# EAGLE design FinalDesign (EAGLE 9.6.2)
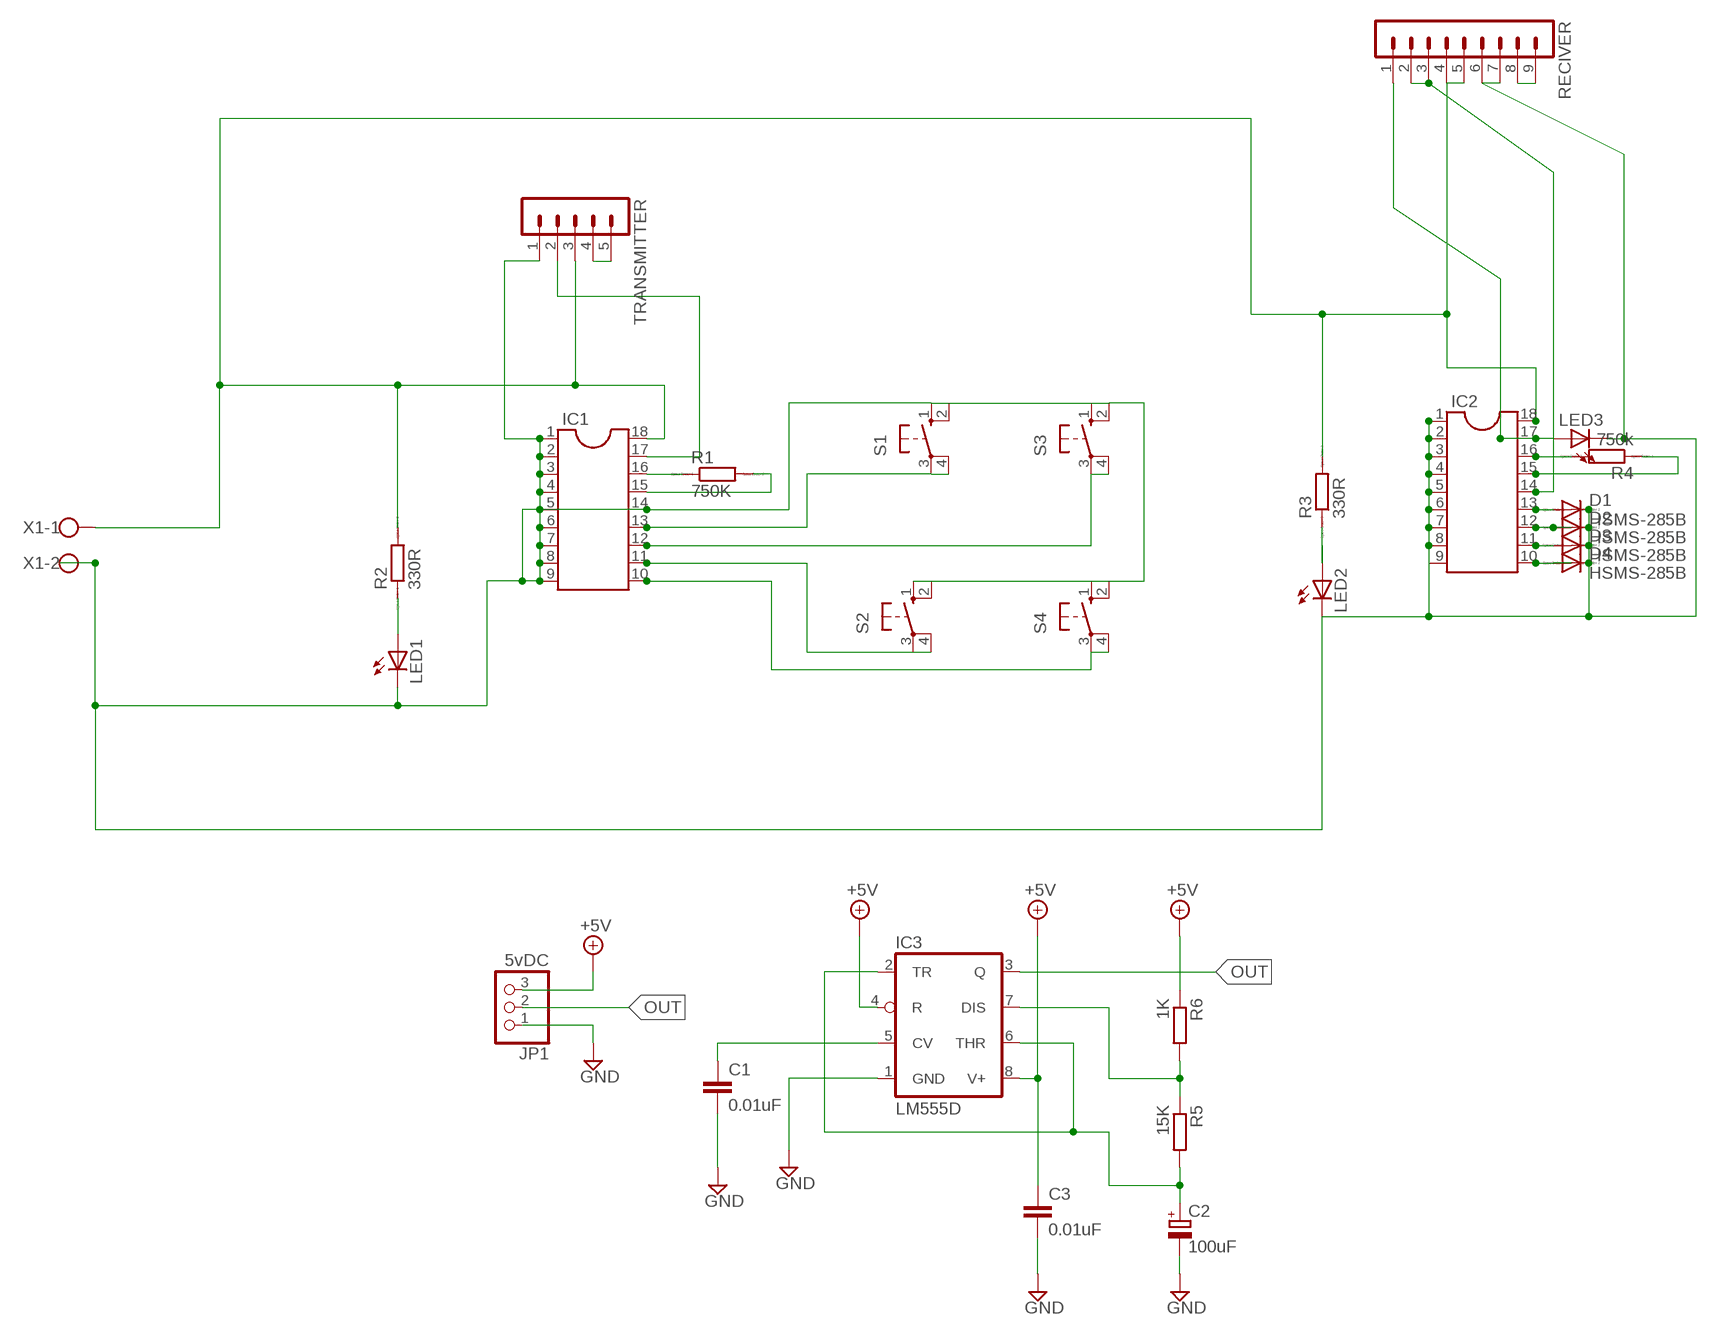
[diagram p0: schematic, sheet 1]

## Parts
C1  0.01uF  C-EUC0805  [C0805]
C2  100uF  CPOL-EUE2.5-5  [E2,5-5]
C3  0.01uF  C-EUC0805  [C0805]
D1  HSMS-285B  [SOT323]
D2  HSMS-285B  [SOT323]
D3  HSMS-285B  [SOT323]
D4  HSMS-285B  [SOT323]
IC1  DIL18  [DIL18]
IC2  DIL18  [DIL18]
IC3  LM555D  [SO08]
JP1  5vDC  PINHD-1X3  [1X03]
LED1  LED5MM  [LED5MM]
LED2  LED5MM  [LED5MM]
LED3  LED5MM  [LED5MM]
R1  750K  R0207/10  [0207/10]
R2  330R  R0207/10  [0207/10]
R3  330R  R0204/7  [0204/7]
R4  750k  R0204/7  [0204/7]
R5  15K  R-EU_M0805  [M0805]
R6  1K  R-EU_M0805  [M0805]
RECIVER  MA09-1  [MA09-1]
S1  10-XX  [B3F-10XX]
S2  10-XX  [B3F-10XX]
S3  10-XX  [B3F-10XX]
S4  10-XX  [B3F-10XX]
TRANSMITTER  MA05-1  [MA05-1]
X1  W237-102  [W237-102]

## Nets
+5V: C3.1 IC3.4(R) IC3.8(V+) JP1.3 R6.1
GND: C1.2 C2.- C3.2 D1.3(C) D2.3(C) D3.3(C) D4.3(C) IC1.1 IC1.2 IC1.3 IC1.4 IC1.5 IC1.6 IC1.7 IC1.8 IC1.9 IC1.14 IC2.1 IC2.2 IC2.3 IC2.4 IC2.5 IC2.6 IC2.7 IC2.8 IC2.9 IC3.1(GND) JP1.1 LED1.K(C) LED2.K(C) LED3.K(C) RECIVER.6 RECIVER.7 S1.1(S) S1.2(S1) S2.1(S) S2.2(S1) S3.1(S) S3.2(S1) S4.1(S) S4.2(S1) TRANSMITTER.1 X1.2
N$1: LED2.A R3.1
N$2: IC1.13 S1.3(P) S1.4(P1)
N$3: LED1.A R2.1
N$4: IC1.16 R1.1
N$5: IC1.15 R1.2
N$6: IC1.11 S2.3(P) S2.4(P1)
N$7: C1.1 IC3.5(CV)
N$8: D1.1(A) IC2.13
N$9: IC1.10 S4.3(P) S4.4(P1)
N$10: IC1.12 S3.3(P) S3.4(P1)
N$11: D2.1(A) IC2.12
N$12: D3.1(A) IC2.11
N$13: D4.1(A) IC2.10
N$14: TRANSMITTER.4 TRANSMITTER.5
N$15: IC1.17 TRANSMITTER.2
N$16: RECIVER.8 RECIVER.9
N$17: IC2.17 LED3.A RECIVER.1
N$18: IC2.16 R4.2
N$19: IC2.15 R4.1
N$20: C2.+ IC3.2(TR) IC3.6(THR) R5.2
N$21: IC2.14 RECIVER.2 RECIVER.3
N$22: IC3.7(DIS) R5.1 R6.2
OUT: IC3.3(Q) JP1.2
VCC: IC1.18 IC2.18 R2.2 R3.2 RECIVER.4 RECIVER.5 TRANSMITTER.3 X1.1

## Library data of the parts
C1 C3 = rcl:C-EU: CAPACITOR, European symbol; SPICEPREFIX: C
C2 = rcl:CPOL-EU: POLARIZED CAPACITOR, European symbol; SPICEPREFIX: C
D1-D4 = avago:HSMS-285B: Surface Mount Microwave Schottky Detector Diodes Source: Data sheet <http://www.farnell.com/datasheets/461166.pdf>
IC1 IC2 = ic-package:DIL18: Dual In Line / Socket
IC3 = linear:*555: TIMER
JP1 = pinhead:PINHD-1X3: PIN HEADER
LED1-LED3 = led:LED: LED OSRAM: - CHIPLED LG R971, LG N971, LY N971, LG Q971, LY Q971, LO R971, LY R971 LH N974, LH R974 LS Q976, LO Q976, LY Q976 LO Q996 - Hyper CHIPLED LW Q18S LB Q993, LB Q99A, LB R99A - SideLED LS A670, LO A670, LY A670, LG A670, LP A670 LB A673, LV A673, LT A673, LW A673 LH A674 LY A675 LS A676, LA A676, LO A676, LY A676, LW A676 LS A679, LY A679, LG A679 - Hyper Micro SIDELED® LS Y876, LA Y876, LO Y876, LY Y876 LT Y87S - SmartLED LW L88C, LW L88S LB L89C, LB L89S, LG L890 LS L89K, LO L89K, LY L89K LS L896, LA L896, LO L896, LY L896 - TOPLED LS T670, LO T670, LY T670, LG T670, LP T670 LSG T670, LSP T670, LSY T670, LOP T670, LYG T670 LG T671, LOG T671, LSG T671 LB T673, LV T673, LT T673, LW T673 LH T674 LS T676, LA T676, LO T676, LY T676, LB T676, LH T676, LSB T676, LW T676 LB T67C, LV T67C, LT T67C, LS T67K, LO T67K, LY T67K, LW E67C LS E67B, LA E67B, LO E67B, LY E67B, LB E67C, LV E67C, LT E67C LW T67C LS T679, LY T679, LG T679 LS T770, LO T770, LY T770, LG T770, LP T770 LB T773, LV T773, LT T773, LW T773 LH T774 LS E675, LA E675, LY E675, LS T675 LS T776, LA T776, LO T776, LY T776, LB T776 LHGB T686 LT T68C, LB T68C - Hyper Mini TOPLED® LB M676 - Mini TOPLED Santana® LG M470 LS M47K, LO M47K, LY M47K Source: http://www.osram.convergy.de LUXEON: - LUMILED® LXK2-PW12-R00, LXK2-PW12-S00, LXK2-PW14-U00, LXK2-PW14-V00 LXK2-PM12-R00, LXK2-PM12-S00, LXK2-PM14-U00 LXK2-PE12-Q00, LXK2-PE12-R00, LXK2-PE12-S00, LXK2-PE14-T00, LXK2-PE14-U00 LXK2-PB12-K00, LXK2-PB12-L00, LXK2-PB12-M00, LXK2-PB14-N00, LXK2-PB14-P00, LXK2-PB14-Q00 LXK2-PR12-L00, LXK2-PR12-M00, LXK2-PR14-Q00, LXK2-PR14-R00 LXK2-PD12-Q00, LXK2-PD12-R00, LXK2-PD12-S00 LXK2-PH12-R00, LXK2-PH12-S00 LXK2-PL12-P00, LXK2-PL12-Q00, LXK2-PL12-R00 Source: www.luxeon.com KINGBRIGHT: KA-3528ASYC Source: www.kingbright.com
R1-R4 = eagle-ltspice:R: RESISTOR, European symbol; SPICEMODEL: NONE; SPICEPREFIX: R
R5 R6 = rcl:R-EU_: RESISTOR, European symbol; SPICEPREFIX: R
RECIVER = con-lstb:MA09-1: PIN HEADER; OC_FARNELL: unknown; OC_NEWARK: unknown
S1-S4 = switch-omron:10-XX: OMRON SWITCH; MPN: B3F-1000; OC_FARNELL: 176432; OC_NEWARK: 36M3542
TRANSMITTER = con-lstb:MA05-1: PIN HEADER; OC_FARNELL: unknown; OC_NEWARK: unknown
X1 = con-wago-500:W237-102: WAGO SCREW CLAMP; MPN: 237-102; OC_FARNELL: unknown; OC_NEWARK: 70K9898

## Board
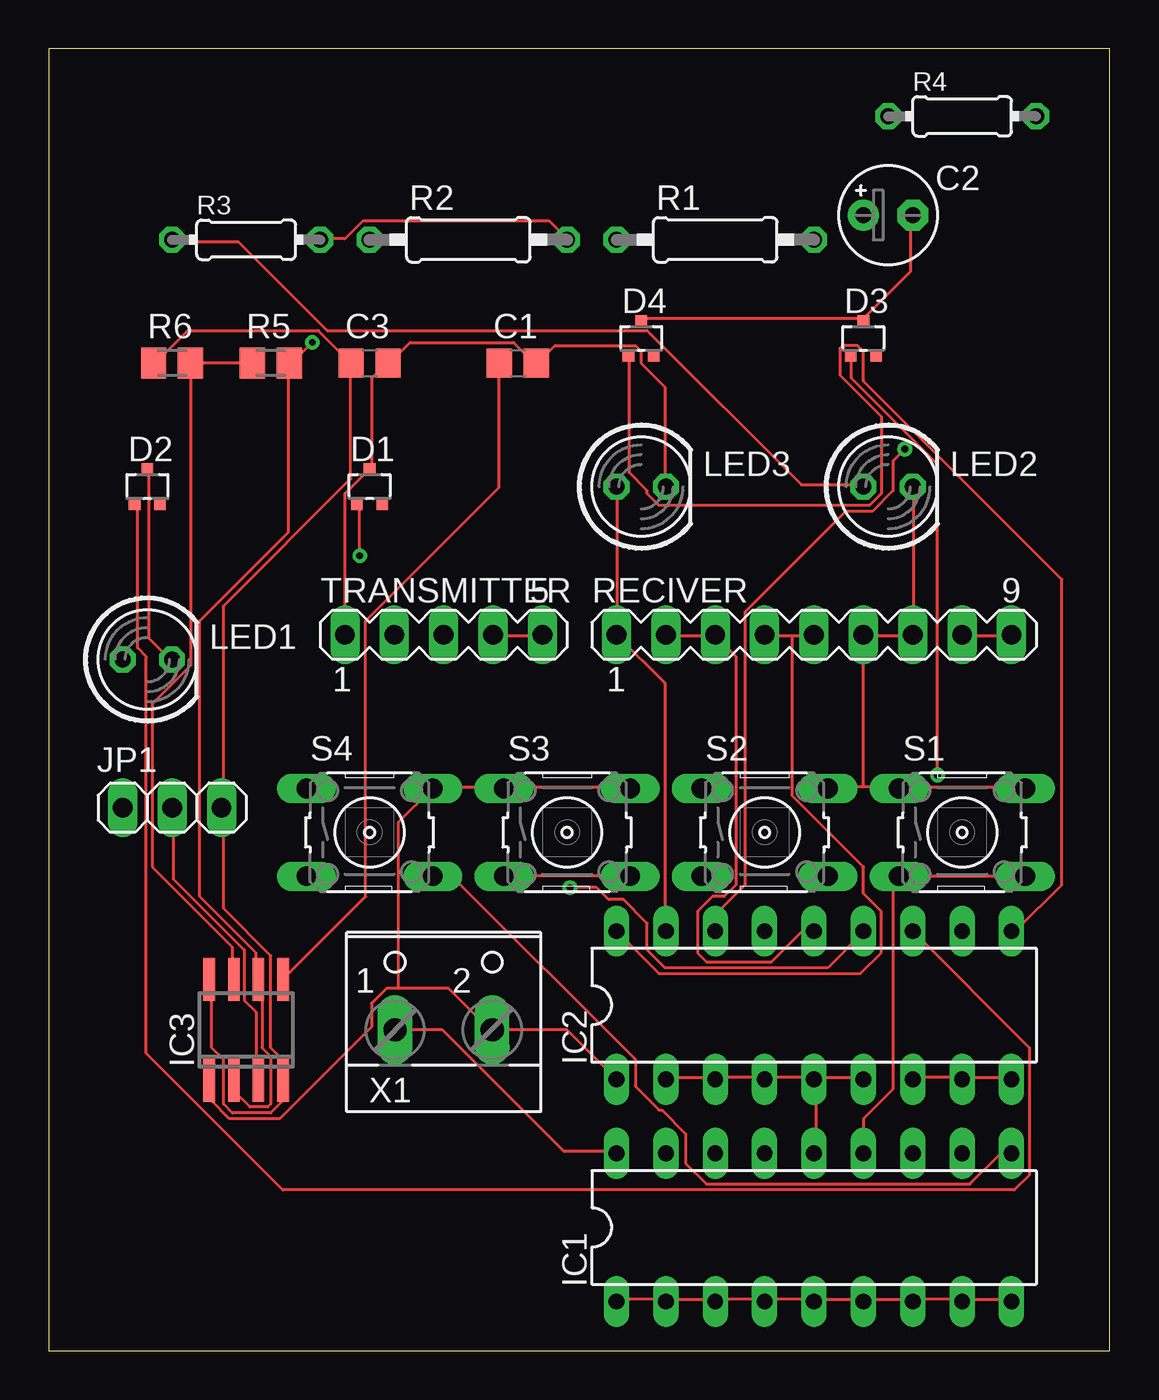
[diagram p1: board, top side]
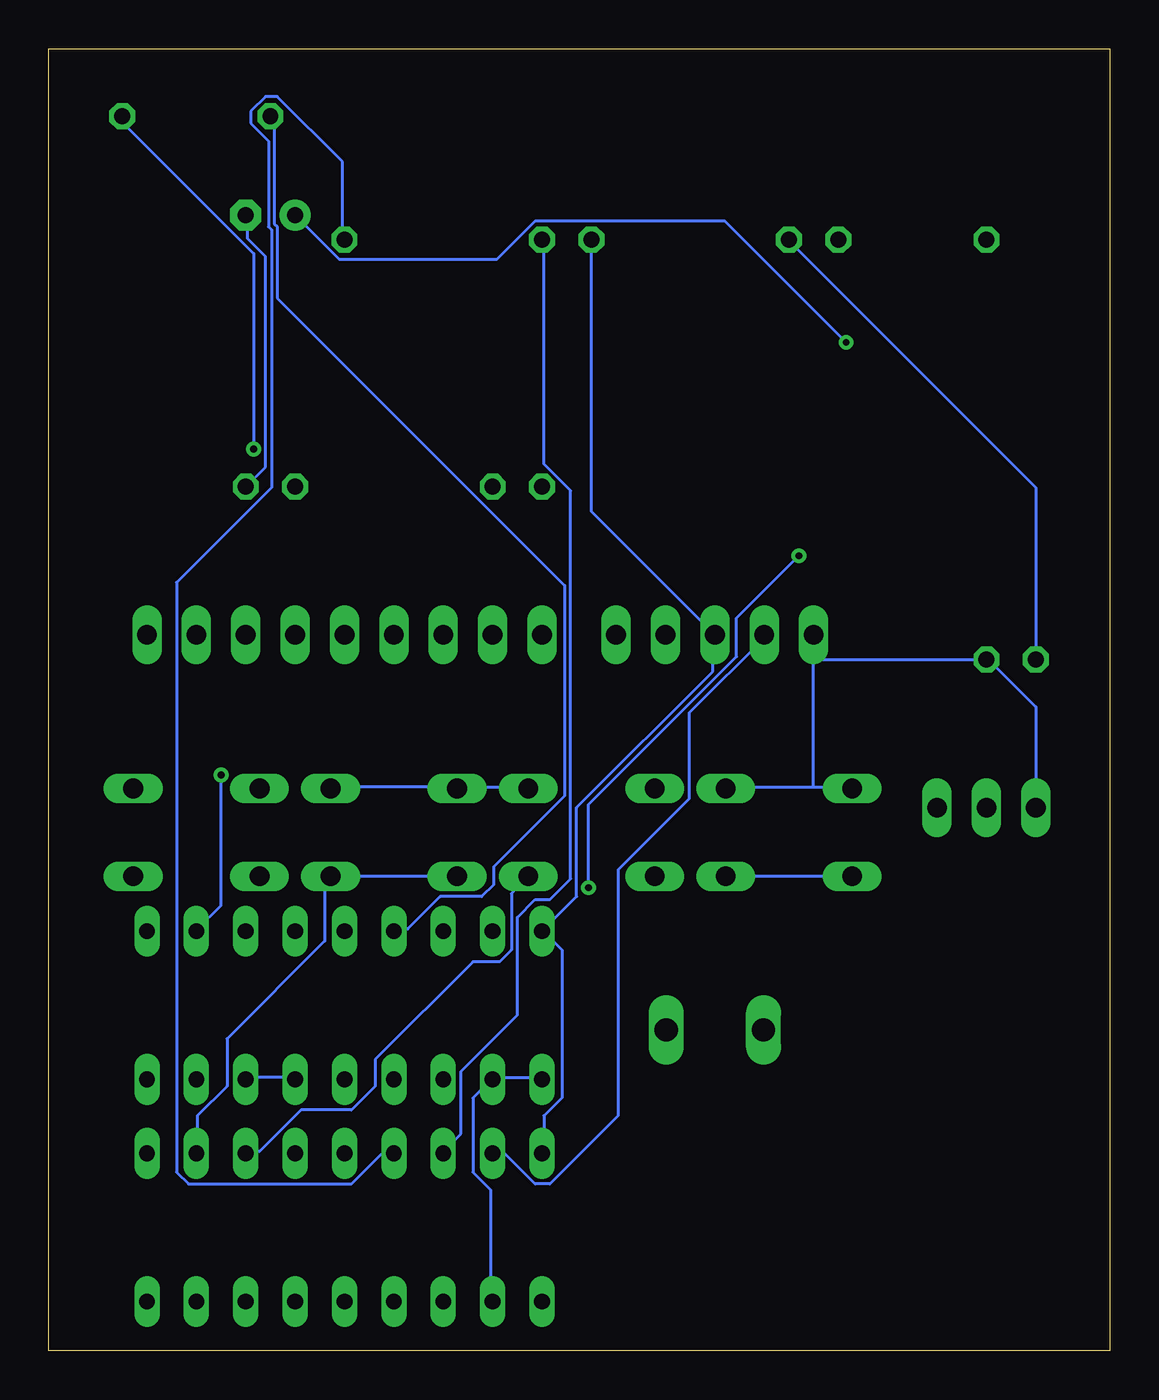
[diagram p2: board, bottom side, seen from below]

Size 54.59 x 66.98 mm. Coordinates in mm from the lower left corner, seen from the top.
Outline: 0,0 54.59,0 54.59,66.98 0,66.98 0,0
Copper layers (1*16): Top 0.035mm / dielectric 1.5mm / Bottom 0.035mm
Design rules "default": minimum track width 6mil, minimum drill 0.35mm, track to track 6mil, track to pad 6mil, pad to pad 6mil, via to via 6mil, smd to smd 6mil, copper to edge 40mil, drill to drill 6mil, minimum pad ring 10mil, minimum via ring 8mil, stop-mask expansion 4mil, vias tented up to drill 0mil, thermal gap 10mil

### Footprints (pad centres in the part's own frame; a part is rotated, then mirrored left to right if it is on the bottom)
C0805 = smd 1.3 x 1.5: 1 -0.95,0; 2 0.95,0
E2,5-5 = drill 0.813 pad 1.6: + -1.27,0 | drill 0.813 pad 1.6 octagon: - 1.27,0
SOT323 = smd 0.6 x 0.55: 1 -0.65,-0.925; 2 0.65,-0.925; 3 0,0.925
DIL18 = drill 0.813 long: 1 -10.16,-3.81; 2 -7.62,-3.81; 3 -5.08,-3.81; 4 -2.54,-3.81; 5 0,-3.81; 6 2.54,-3.81; 7 5.08,-3.81; 8 7.62,-3.81; 9 10.16,-3.81; 10 10.16,3.81; 11 7.62,3.81; 12 5.08,3.81; 13 2.54,3.81; 14 0,3.81; 15 -2.54,3.81; 16 -5.08,3.81; 17 -7.62,3.81; 18 -10.16,3.81
SO08 = smd 0.6 x 2.2: 1 -1.905,-2.6; 2 -0.635,-2.6; 3 0.635,-2.6; 4 1.905,-2.6; 5 1.905,2.6; 6 0.635,2.6; 7 -0.635,2.6; 8 -1.905,2.6
1X03 = drill 1.016 long: 1 -2.54,0; 2 0,0; 3 2.54,0
LED5MM = drill 0.813 octagon: A -1.27,0; K 1.27,0
0207/10 = drill 0.813 octagon: 1 -5.08,0; 2 5.08,0
0204/7 = drill 0.813 octagon: 1 -3.81,0; 2 3.81,0
M0805 = smd 1.3 x 1.6: 1 -0.95,0; 2 0.95,0
MA09-1 = drill 1.016 long: 1 -10.16,0; 2 -7.62,0; 3 -5.08,0; 4 -2.54,0; 5 0,0; 6 2.54,0; 7 5.08,0; 8 7.62,0; 9 10.16,0
B3F-10XX = drill 1.016 long: 1 -3.251,2.261; 2 3.251,2.261; 3 -3.251,-2.261; 4 3.251,-2.261
MA05-1 = drill 1.016 long: 1 -5.08,0; 2 -2.54,0; 3 0,0; 4 2.54,0; 5 5.08,0
W237-102 = drill 1.194 long: 1 -2.5,-1.27; 2 2.5,-1.27

### Placement (x,y rotation side)
C1  24.13,50.8 0 top
C2  43.18,58.42 0 top
C3  16.51,50.8 0 top
D1  16.51,44.45 0 top
D2  5.08,44.45 0 top
D3  41.91,52.07 0 top
D4  30.48,52.07 0 top
IC1  39.37,6.35 0 top
IC2  39.37,17.78 0 top
IC3  10.16,16.51 0 top
JP1  6.35,27.94 0 top
LED1  5.08,35.56 0 top
LED2  43.18,44.45 0 top
LED3  30.48,44.45 0 top
R1  34.29,57.15 0 top
R2  21.59,57.15 0 top
R3  10.16,57.15 0 top
R4  46.99,63.5 0 top
R5  11.43,50.8 0 top
R6  6.35,50.8 0 top
RECIVER  39.37,36.83 0 top
S1  46.99,26.67 0 top
S2  36.83,26.67 0 top
S3  26.67,26.67 0 top
S4  16.51,26.67 0 top
TRANSMITTER  20.32,36.83 0 top
X1  20.32,17.78 0 top

### Tracks (layer width: path | path; a pad name or v marks a point on that pad's centre or on a via)
+5V
  Top 0.152: 15.55,50.8 13.87,52.48 7.16,52.48 5.49,50.8 R6.1 | IC3.8 8.38,19.1 8.38,15.6 8.99,14.99 8.99,12.7 9.45,12.24 11.43,12.24 12.04,12.85 12.04,13.77 IC3.4 12.04,13.92 12.04,14.99 11.43,15.6 11.43,20.32 8.99,22.76 8.99,27.94 | 15.55,50.8 15.55,44.86 8.99,38.3 8.99,27.94 | 15.55,50.8 C3.1 | 8.99,27.94 JP1.3
GND
  Top 0.152: IC1.9 49.53,2.64 47.09,2.64 IC1.8 46.94,2.64 44.5,2.64 IC1.7 44.35,2.64 41.91,2.64 | IC1.1 29.26,2.64 31.7,2.64 IC1.2 31.85,2.64 34.29,2.64 | 41.91,2.64 39.47,2.64 IC1.5 39.32,2.64 36.88,2.64 IC1.4 36.73,2.64 34.29,2.64 | 34.29,2.64 IC1.3 | 41.91,2.64 IC1.6 | 17.98,18.64 20.57,18.64 22.71,16.51 X1.2 26.67,16.51 IC2.1 | 17.98,18.64 17.37,18.64 16.61,17.88 16.61,16.66 11.89,11.94 9.3,11.94 8.38,12.85 8.38,13.77 IC3.1 | IC2.7 44.5,14.07 46.94,14.07 IC2.8 47.09,14.07 49.53,14.07 IC2.9 | 34.29,14.07 31.85,14.07 IC2.2 | IC1.14 39.47,10.26 39.47,13.92 IC2.5 | IC2.5 39.32,14.07 36.88,14.07 IC2.4 36.73,14.07 34.29,14.07 | IC2.6 41.91,14.07 39.47,14.07 IC2.5 | 34.29,14.07 IC2.3 | 41.91,53.09 30.48,53.09 D4.3 | 41.91,53.09 44.35,55.52 44.35,58.42 C2.- | 41.91,53.09 D3.3 | LED2.K 44.5,44.4 44.5,36.93 RECIVER.7 44.35,36.78 41.91,36.78 | 43.74,29.01 41.91,29.01 | 41.91,29.01 40.08,29.01 S2.2 | 43.74,29.01 50.14,29.01 S1.2 | 43.74,29.01 S1.1 | 41.91,29.01 41.91,36.78 | 41.91,36.78 RECIVER.6 | LED3.K 31.7,44.55 31.7,49.58 30.48,50.8 30.48,51.41 30.17,51.71 26.06,51.71 25.15,50.8 C1.2 24.99,50.8 23.93,51.87 18.59,51.87 17.53,50.8 C3.2 17.37,50.8 16.61,50.04 16.61,45.47 D1.3 16.46,45.31 15.24,44.09 TRANSMITTER.1 | D2.3 5.18,45.31 5.18,36.63 6.25,35.56 LED1.K | S3.2 29.87,29.01 23.47,29.01 S3.1 23.32,29.01 19.81,29.01 S4.2 19.66,28.85 17.98,27.18 17.98,18.64
  Bottom 0.152: IC2.1 29.26,14.07 31.7,14.07 IC2.2 31.85,13.92 32.77,13 32.77,9.2 31.85,8.28 31.85,2.64 IC1.2 | IC2.7 44.35,14.07 41.91,14.07 IC2.6 | LED2.K 43.43,45.47 43.43,56.29 44.35,57.2 44.35,58.42 C2.- | JP1.1 3.81,33.12 6.25,35.56 LED1.K 15.24,35.56 | S3.2 30.02,29.01 33.53,29.01 S2.1 33.68,29.01 40.08,29.01 S2.2 | 15.24,29.01 19.66,29.01 S4.2 | 15.24,29.01 13.26,29.01 S4.1 | 15.24,29.01 15.24,35.56 | 15.24,35.56 TRANSMITTER.1 15.24,36.78
N$1
  Top 0.152: LED2.A 41.91,44.55 38.71,44.55 30.78,52.48 14.33,52.48 9.75,57.05 6.4,57.05 R3.1
N$2
  Top 0.152: IC1.13 41.91,11.94 43.43,13.46 43.43,23.98 43.74,24.28 S1.3 43.74,24.44 50.14,24.44 S1.4
N$3
  Bottom 0.152: LED1.A 3.81,44.4 16.46,57.05 R2.1
N$4
  Bottom 0.152: R1.1 29.11,57.05 29.11,45.62 27.74,44.25 27.74,24.28 28.8,23.22 29.57,23.22 30.48,22.3 30.48,17.27 33.38,14.38 33.38,11.18 34.29,10.26 IC1.16
N$5
  Bottom 0.152: IC1.15 36.88,10.11 37.49,10.11 39.01,8.58 47.4,8.58 48.01,9.2 48.01,39.52 43.13,44.4 43.13,57.66 43.28,57.81 43.28,62.23 44.2,63.14 44.2,63.75 43.43,64.52 42.82,64.52 39.47,61.16 39.47,57.2 R1.2
N$6
  Bottom 0.152: IC1.11 46.94,10.26 46.94,12.09 45.41,13.61 45.41,16.05 40.39,21.08 40.39,23.98 40.08,24.28 S2.4 40.08,24.44 33.68,24.44 S2.3
N$7
  Top 0.152: C1.1 23.16,50.8 23.16,44.4 16.31,37.54 16.31,23.37 12.19,19.25 IC3.5
N$8  (via drill 0.35)
  Top 0.152: v16,40.89 16,43.48 D1.1 | v26.82,23.82 28.19,23.82 28.8,23.22 29.57,23.22 30.78,22 30.78,20.62 31.7,19.71 40.08,19.71 41.91,21.54 IC2.13
  Bottom 0.152: v16,40.89 19.2,37.69 19.2,35.71 26.82,28.09 v26.82,23.82
N$9
  Top 0.152: IC1.10 49.53,10.11 48.92,10.11 47.4,8.58 33.83,8.58 32.77,9.65 32.77,11.18 31.55,12.39 31.39,12.39 30.17,13.61 30.17,14.99 20.88,24.28 19.81,24.28 S4.4
  Bottom 0.152: S4.3 13.26,24.44 19.66,24.44 S4.4
N$10
  Top 0.152: S3.3 23.47,24.44 29.87,24.44 S3.4
  Bottom 0.152: IC1.12 44.35,10.26 43.74,10.26 41.6,12.39 39.01,12.39 37.8,13.61 37.8,14.99 32.77,20.02 31.39,20.02 30.78,20.62 30.78,23.52 30.02,24.28 S3.4
N$11
  Top 0.152: IC2.12 50.44,15.6 50.44,9.04 49.68,8.28 12.04,8.28 5.03,15.29 5.03,35.71 4.57,36.17 4.57,43.48 D2.1
N$12  (via drill 0.35)
  Top 0.152: v45.72,29.62 45.72,45.62 41.3,50.04 41.3,51.11 D3.1
  Bottom 0.152: v45.72,29.62 45.72,22.91 46.94,21.69 IC2.11
N$13
  Top 0.152: D4.1 29.87,51.11 29.87,45.16 30.78,44.25 30.78,44.09 31.39,43.48 42.22,43.48 42.82,44.09 42.82,48.06 40.69,50.19 40.69,51.56 40.84,51.71 41.6,51.71 41.91,51.41 41.91,49.89 52.12,39.67 52.12,23.98 49.83,21.69 49.53,21.69 IC2.10
N$14
  Top 0.152: TRANSMITTER.4 22.86,36.78 25.3,36.78 TRANSMITTER.5
N$15
  Bottom 0.152: IC1.17 31.7,10.11 31.09,10.11 29.57,8.58 28.8,8.58 25.3,12.09 25.3,24.74 21.64,28.4 21.64,32.82 17.68,36.78 TRANSMITTER.2
N$16
  Top 0.152: RECIVER.8 47.09,36.78 49.53,36.78 RECIVER.9
N$17
  Top 0.152: LED3.A 29.26,44.4 29.26,36.93 RECIVER.1 31.7,34.34 31.7,21.69 IC2.17
N$18  (via drill 0.35)
  Top 0.152: IC2.16 34.29,22.45 35.81,23.98 35.81,38 41,43.18 42.37,43.18 43.43,44.25 43.43,45.77 v44.04,46.38
  Bottom 0.152: v44.04,46.38 44.04,56.44 50.75,63.14 50.75,63.45 R4.2
N$19
  Bottom 0.152: R4.1 42.98,63.3 42.98,57.96 42.82,57.81 42.82,54.15 28.04,39.37 28.04,28.55 31.7,24.89 31.7,23.98 32.31,23.37 34.44,23.37 36.12,21.69 36.73,21.69 IC2.15
N$20  (via drill 0.35)
  Top 0.152: IC3.2 9.6,13.77 9.6,13.31 10.36,12.55 11.28,12.55 11.43,12.7 11.43,15.14 10.97,15.6 10.97,18.95 10.82,19.1 IC3.6 10.67,19.25 10.67,20.47 7.77,23.37 7.77,37.54 12.34,42.11 12.34,50.8 R5.2 12.5,50.8 v13.56,51.87
  Bottom 0.152: C2.+ 39.62,56.13 31.55,56.13 29.57,58.11 19.81,58.11 v13.56,51.87
N$21
  Top 0.152: 34.29,36.78 35.36,35.71 35.36,23.98 34.75,23.37 34.14,23.37 33.38,22.61 33.38,20.47 33.83,20.02 37.19,20.02 38.71,21.54 39.32,21.54 IC2.14 | 34.29,36.78 31.85,36.78 RECIVER.2 | 34.29,36.78 RECIVER.3
N$22
  Top 0.152: R5.1 7.31,50.8 | 7.31,50.8 7.31,35.25 5.33,33.27 5.33,24.89 9.45,20.78 9.45,19.25 IC3.7 | 7.31,50.8 R6.2
OUT
  Top 0.152: IC3.3 10.67,13.92 10.67,17.42 10.06,18.03 10.06,20.62 6.4,24.28 6.4,27.94 JP1.2
VCC
  Top 0.152: R3.2 14.02,57.2 15.24,57.2 16.15,58.11 25.76,58.11 26.67,57.2 R2.2 | 38.25,36.78 39.32,36.78 RECIVER.5 | 38.25,36.78 36.88,36.78 RECIVER.4 | X1.1 20.27,16.51 26.52,10.26 29.11,10.26 IC1.18 | 38.25,36.78 38.25,28.55 41.91,24.89 41.91,23.52 42.82,22.61 42.82,20.47 41.76,19.41 31.39,19.41 IC2.18
  Bottom 0.152: IC1.18 29.11,10.26 29.11,12.09 28.19,13 28.19,20.62 29.11,21.54 IC2.18 27.43,23.37 27.43,27.94 20.42,34.95 20.42,36.78 TRANSMITTER.3 26.67,43.18 R2.2